# EAGLE schematic schematic_D_Amplifier (1) (EAGLE 9.6.2)
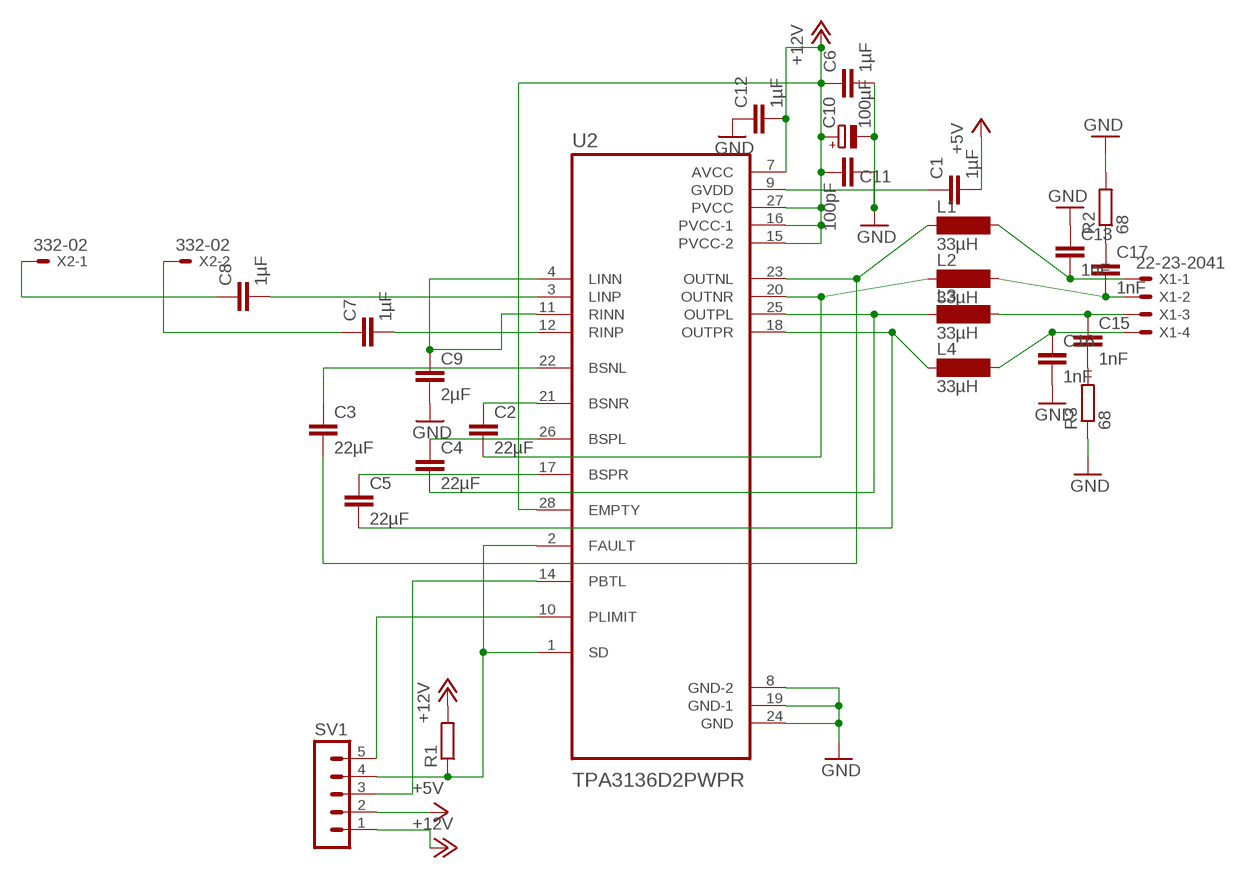
[diagram p0: schematic, sheet 1]

## Parts
C1  1µF  C-EU025-025X050  [C025-025X050]
C2  22µF  C-EU025-025X050  [C025-025X050]
C3  22µF  C-EU025-025X050  [C025-025X050]
C4  22µF  C-EU025-025X050  [C025-025X050]
C5  22µF  C-EU025-025X050  [C025-025X050]
C6  1µF  C-EU025-025X050  [C025-025X050]
C7  1µF  C-EU025-025X050  [C025-025X050]
C8  1µF  C-EU025-025X050  [C025-025X050]
C9  2µF  C-EU025-025X050  [C025-025X050]
C10  100µF  CPOL-EU140CLH-1010  [140CLH-1010]
C11  100pF  C-EU025-025X050  [C025-025X050]
C12  1µF  C-EU025-025X050  [C025-025X050]
C13  1nF  C-EU025-025X050  [C025-025X050]
C15  1nF  C-EU025-025X050  [C025-025X050]
C16  1nF  C-EU025-025X050  [C025-025X050]
C17  1nF  C-EU025-025X050  [C025-025X050]
L1  33µH  SD12-680  [SD12-680]
L2  33µH  SD12-680  [SD12-680]
L3  33µH  SD12-680  [SD12-680]
L4  33µH  SD12-680  [SD12-680]
R1  R-EU_0204/7  [0204/7]
R2  68  R-EU_0204/7  [0204/7]
R3  68  R-EU_0204/7  [0204/7]
SV1  MA05-1  [MA05-1]
U2  TPA3136D2PWPR  [IC_TPS61196PWPRQ1]
X1  22-23-2041  [22-23-2041]
X2  332-02  [332-02]

## Nets
+5V: C1.2 SV1.2
+12V: C6.1 C10.+ C11.2 C12.2 R1.2 SV1.1 U2.7(AVCC) U2.15(PVCC-2) U2.16(PVCC-1) U2.27(PVCC) U2.28(EMPTY)
GND: C6.2 C9.2 C10.- C11.1 C12.1 C13.1 C16.2 R2.2 R3.1 U2.8(GND-2) U2.19(GND-1) U2.24(GND)
N$1: C7.2 U2.12(RINP)
N$2: C8.2 U2.3(LINP)
N$3: SV1.5 U2.10(PLIMIT)
N$4: C3.2 L1.1 U2.23(OUTNL)
N$5: C2.2 L2.1 U2.20(OUTNR)
N$6: C4.2 L3.1 U2.25(OUTPL)
N$7: C5.2 L4.1 U2.18(OUTPR)
N$8: R1.1 SV1.4 U2.1(SD) U2.2(FAULT)
N$9: SV1.3 U2.14(PBTL)
N$10: C2.1 U2.21(BSNR)
N$11: C4.1 U2.26(BSPL)
N$12: C5.1 U2.17(BSPR)
N$13: C3.1 U2.22(BSNL)
N$14: C1.1 U2.9(GVDD)
N$15: C7.1 X2.2
N$16: C8.1 X2.1
N$17: C9.1 U2.4(LINN) U2.11(RINN)
N$18: C13.2 L1.2 X1.1
N$19: C17.2 L2.2 X1.2
N$20: C15.1 L3.2 X1.3
N$21: C16.1 L4.2 X1.4
N$22: C17.1 R2.1
N$23: C15.2 R3.2

## Library data of the parts
C1-C9 C11-C13 C15-C17 = rcl:C-EU: CAPACITOR, European symbol; SPICEPREFIX: C
C10 = rcl:CPOL-EU: POLARIZED CAPACITOR, European symbol; SPICEPREFIX: C
L1-L4 = inductor-neosid:SD12: INDUCTOR nominal inductance; MF: BUSSMANN; MPN: SD12-680; OC_FARNELL: unknown; OC_NEWARK: 19K7201
R1-R3 = rcl:R-EU_: RESISTOR, European symbol; SPICEPREFIX: R
SV1 = con-lstb:MA05-1: PIN HEADER; OC_FARNELL: unknown; OC_NEWARK: unknown
U2 = TPA3136D2PWPR:TPA3136D2PWPR: Check prices <https://pricing.snapeda.com/parts/TPA3136D2PWPR/Texas%20Instruments/view-part?ref=eda>; AVAILABILITY: Warning; DESCRIPTION: 10-W stereo, 20-W mono, 4.5- to 14.4-V, analog in Class-D audio amplifier w/ inductor free & low EMI 28-HTSSOP -40 to 85; MF: Texas Instruments; MP: TPA3136D2PWPR; PACKAGE: HTSSOP-28 Texas Instruments; PRICE: None; PURCHASE-URL: https://pricing.snapeda.com/search/part/TPA3136D2PWPR/?ref=eda
X1 = con-molex:22-23-2041: .100" (2.54mm) Center Header - 4 Pin; MF: MOLEX; MPN: 22-23-2041; OC_FARNELL: 1462920; OC_NEWARK: 38C0355
X2 = con-garry:332-02: 2 Pin - 2mm Dual Row Source: www.mpe-connector.de / garry_shortform_2012.pdf